# EasyEDA schematic SCH_Arduino-Tx_2024-08-14.json
TITLE: Sheet_1; REV: 1.0; Date: 2024-22-07; Sheet: 1/1; Drawn By: ANSHUMANDOCX; Company: Your Company
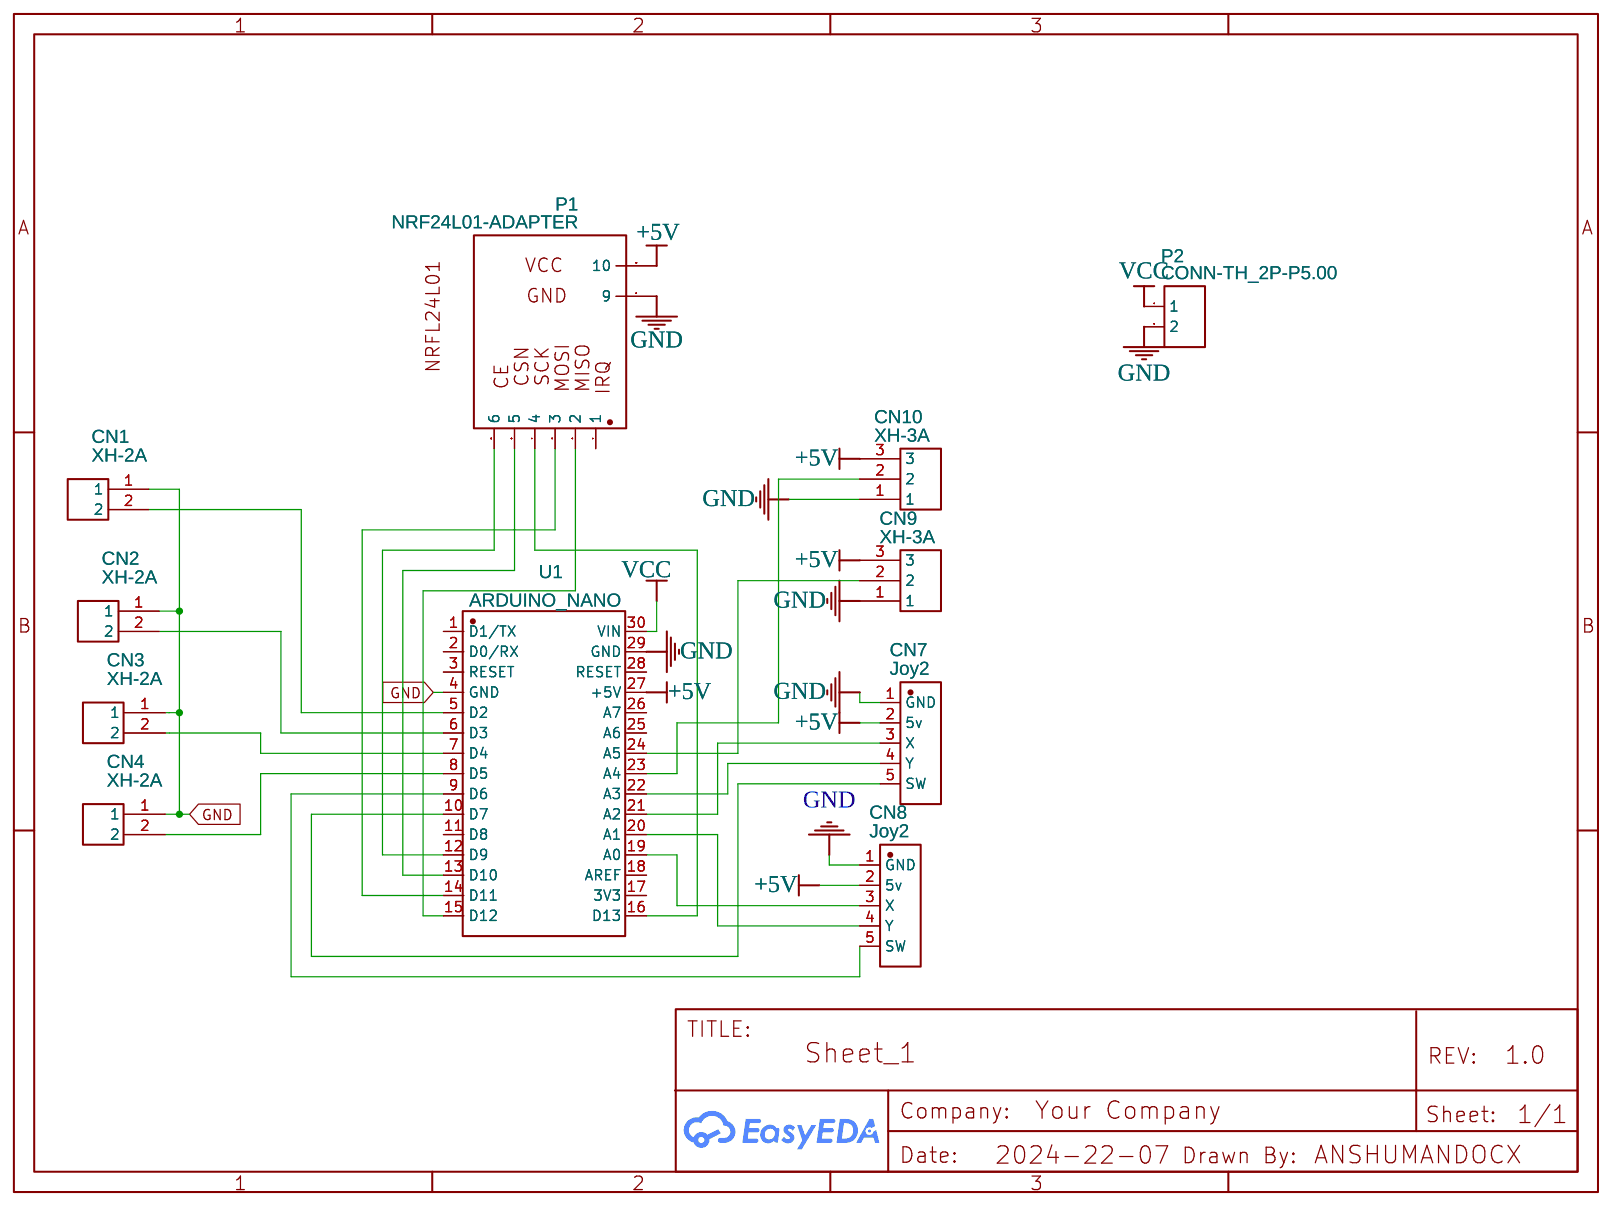
[diagram p0: schematic sheet]

## Parts
CN1  XH-2A  [CONN-TH_XH-2A]
CN2  XH-2A  [CONN-TH_XH-2A]
CN3  XH-2A  [CONN-TH_XH-2A]
CN4  XH-2A  [CONN-TH_XH-2A]
CN7  Joy2  [CONN-TH_5P-P2.50_XH-5A_C2318]
CN8  Joy2  [CONN-TH_5P-P2.50_XH-5A_C2318]
CN9  XH-3A  [CONN-TH_XH-3A]
CN10  XH-3A  [CONN-TH_XH-3A]
P1  NRF24L01-ADAPTER  [NRF24L01-ADAPTER-PCB]
P2  CONN-TH_2P-P5.00  [CONN-TH_2P-P5.00]
U1  ARDUINO_NANO  [COMM-TH_ARDUINO_NANO]

## Library data of the parts
CN1-CN4 = XH-2A: Supplier: LCSC; Manufacturer: BOOMELE(博穆精密); Supplier Part: C20079; JLCPCB Part Class: Extended Part
CN7 CN8 = XH-5A: Supplier: LCSC; Manufacturer: BOOMELE(博穆精密); Supplier Part: C2318; JLCPCB Part Class: Extended Part
CN9 CN10 = XH-3A: Supplier: LCSC; Manufacturer: BOOMELE(博穆精密); Supplier Part: C2316; JLCPCB Part Class: Extended Part
P1 = NRF24L01-ADAPTER: Supplier: LCSC; Manufacturer: ReliaPro; Manufacturer Part: WJ2EDGVC-5.08-06P; image: //image.lceda.cn/szlcsc/C8449.jpg; Supplier Part: C8449; Contributor: Jose Luis
P2 = CONN-TH_2P-P5.00: Supplier: LCSC; Contributor: LCEDA_Lib
U1 = ARDUINO_NANO: Contributor: lcsc; Supplier: LCSC; Supplier Part: C9900017879; Manufacturer: null; JLCPCB Part Class: Extended Part

## Nets
+5V: CN7.2(5v) CN8.2(5v) CN9.3 CN10.3 P1.10 U1.27(+5V)
GND: CN1.1 CN2.1 CN3.1 CN4.1 CN7.1(GND) CN8.1(GND) CN9.1 CN10.1 P1.9 P2.2 U1.4(GND) U1.29(GND)
VCC: P2.1 U1.30(VIN)
Net-(CN1-2): CN1.2 U1.5(D2)
Net-(CN2-2): CN2.2 U1.6(D3)
Net-(CN3-2): CN3.2 U1.7(D4)
Net-(CN4-2): CN4.2 U1.8(D5)
Net-(CN7-3): CN7.3(X) U1.21(A2)
Net-(CN7-4): CN7.4(Y) U1.22(A3)
Net-(CN7-5): CN7.5(SW) U1.10(D7)
Net-(CN8-3): CN8.3(X) U1.19(A0)
Net-(CN8-4): CN8.4(Y) U1.20(A1)
Net-(CN8-5): CN8.5(SW) U1.9(D6)
Net-(CN9-2): CN9.2 U1.24(A5)
Net-(CN10-2): CN10.2 U1.23(A4)
Net-(P1-2): P1.2 U1.15(D12)
Net-(P1-3): P1.3 U1.14(D11)
Net-(P1-4): P1.4 U1.16(D13)
Net-(P1-5): P1.5 U1.13(D10)
Net-(P1-6): P1.6 U1.12(D9)

Not connected (* = marked no-connect by the designer): P1 1; U1 1(D1/TX) 2(D0/RX) 3(RESET) 11(D8) 17(3V3) 18(AREF) 25(A6) 26(A7) 28(RESET)
